# Altium project CCA-00012__sdaf__A.PrjPcb
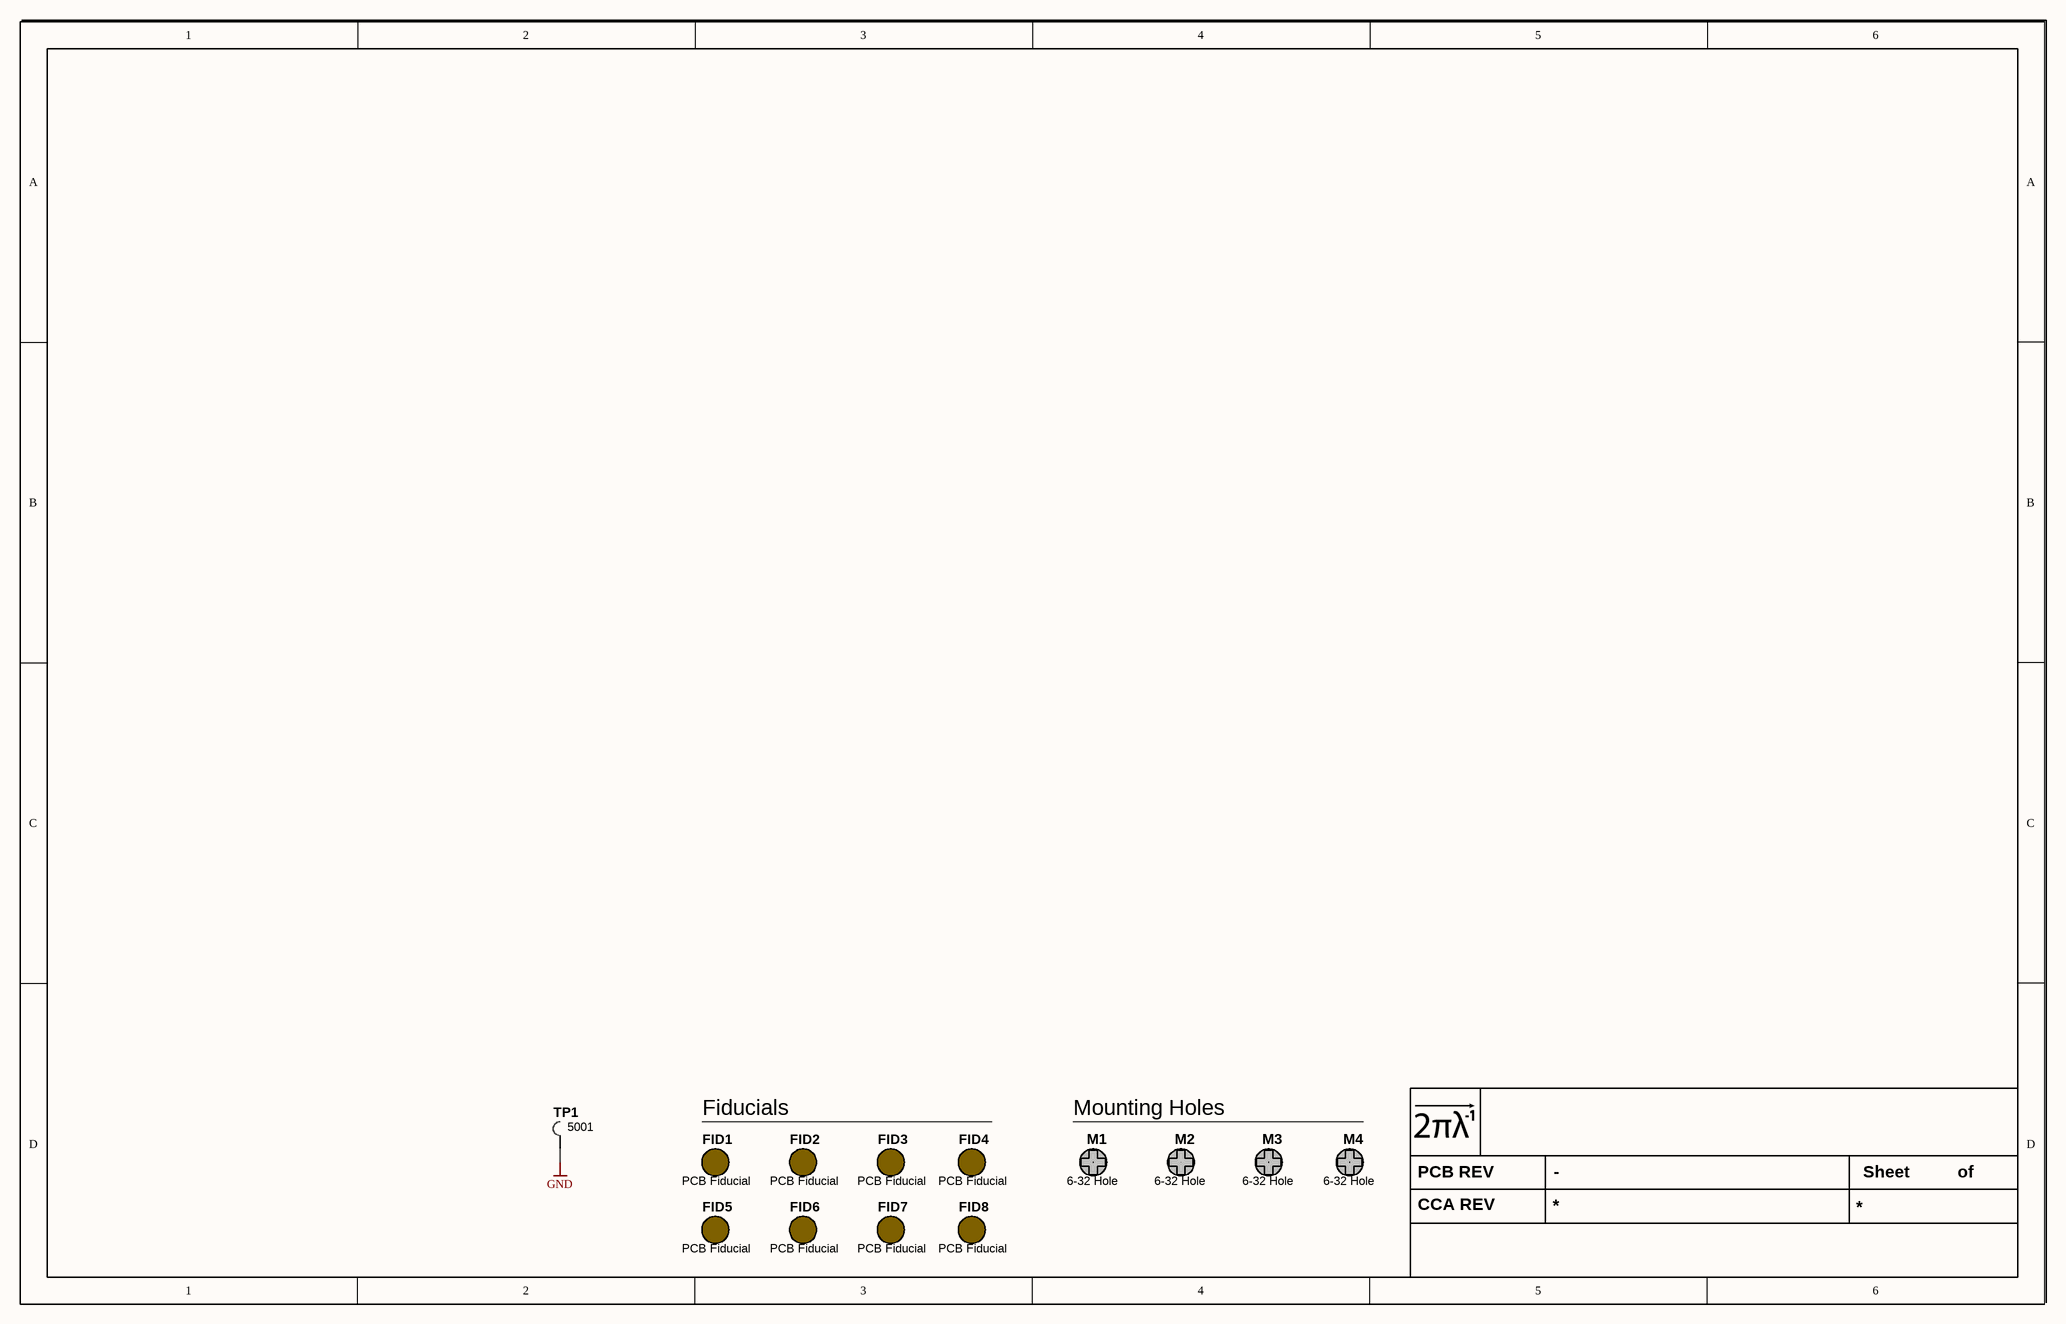
[diagram p0:  sdaf__TOP_LEVEL__A.SchDoc]
 CCA_PART_NUMBER: CCA-00012;  CCA_TITLE: sdaf;  PCB_PART_NUMBER: sdaf;  PCB_VERSION: A;  PROJECT_ENGINEER: plexus;  PROJECT_STATUS: PROTOTYPE;  PROJECT_TITLE_LINE_1: RT685 Audio Platform;  SCH_DATE: 2023-12-08
1 sheet, 13 parts. Net scope: global (net labels, ports and power ports of the same name join across sheets).
Board file:  sdaf__A.PcbDoc

## Sheet  sdaf__TOP_LEVEL__A.SchDoc
size B; Organization: Altium Limited; Address1: 3 Minna Close; Address2: Belrose; Address3: NSW 2085; Address4: Australia; PAGE_TITLE: -

### Parts
FID1  PCB Fiducial  [Fiducial 1mm - 2mm]  (no BOM)
FID2  PCB Fiducial  [Fiducial 1mm - 2mm]  (no BOM)
FID3  PCB Fiducial  [Fiducial 1mm - 2mm]  (no BOM)
FID4  PCB Fiducial  [Fiducial 1mm - 2mm]  (no BOM)
FID5  PCB Fiducial  [Fiducial 1mm - 2mm]  (no BOM)
FID6  PCB Fiducial  [Fiducial 1mm - 2mm]  (no BOM)
FID7  PCB Fiducial  [Fiducial 1mm - 2mm]  (no BOM)
FID8  PCB Fiducial  [Fiducial 1mm - 2mm]  (no BOM)
M1  6-32 Hole  [6-32 X 0]  (no BOM)
M2  6-32 Hole  [6-32 X 0]  (no BOM)
M3  6-32 Hole  [6-32 X 0]  (no BOM)
M4  6-32 Hole  [6-32 X 0]  (no BOM)
TP1  5001  [5001]

### Nets
GND: TP1.1

Not connected (* = marked no-connect by the designer): M1 1; M2 1; M3 1; M4 1

### Notes on the sheet
- Fiducials
- Mounting Holes
- PCB REV
- Sheet
- of
- CCA REV

### Library data of the parts
FID1-FID8 = Fiducial: Value: PCB Fiducial
TP1 = 5001: KEYSTONE - 5001 - TEST POINT, CONNECTOR, BLACK; Manufacturer: Keystone Electronics; Plating: Silver; Body Material: PBT,Bronze; Number of Ports: 1; Insulation: Insulated; Inside Diameter: 1.27mm; Outside Diameter: 2.54mm; Hole Diameter: 1.6mm; Value: 5001; Supplier 1: Digi-Key; Supplier Part Number 1: 36-5001-ND; Manufacturer Part Number: 5001; RoHS: Yes; Category: Test Probes, Leads and Clips; Stock: 463593; Pricing: 1=0.35000, 10=0.33500, 50=0.24380, 250=0.21032, 1000=0.17140, 2500=0.15296, 5000=0.14340 (USD); Mount: Through Hole,PCB; Color: Black; Contact Material: Bronze; Contact Plating: Silver,Tin; Material: Nylon,Bronze,Silver; Housing Color: Black; Packaging: Bulk; Package Quantity: 100; Termination: Through Hole; Number of Contacts: 1; Orientation: Straight; Diameter: 2.54mm; Length: 7.62mm; Height: 0.3inch; Lead Free: Lead Free; REACH SVHC: No SVHC; Flammability Rating: UL94 V-0; ComponentLink1URL: https://datasheet.ciiva.com/27052/1581986-27052611.pdf?src-supplier=Jameco; ComponentLink1Description: https://datasheet.ciiva.com/27052/1581986-27052611.pdf?src-supplier=Jameco; ComponentLink2URL: https://datasheet.ciiva.com/11836/0900766b8009b7c7-11836045.pdf?src-supplier=RSComponents; ComponentLink2Description: https://datasheet.ciiva.com/11836/0900766b8009b7c7-11836045.pdf?src-supplier=RSComponents; ComponentLink3URL: https://datasheet.ciiva.com/16318/m60-2p60-16318423.pdf?src-supplier=Future+Electronics; ComponentLink3Description: https://datasheet.ciiva.com/16318/m60-2p60-16318423.pdf?src-supplier=Future+Electronics; ComponentLink4URL: https://datasheet.ciiva.com/22631/1703983-22631100.pdf?src-supplier=Element14; ComponentLink4Description: https://datasheet.ciiva.com/22631/1703983-22631100.pdf?src-supplier=Element14
M1-M4 = 6-32 Hole: Source: Digikey; Source Part Number: *; Manufacturer: *; Manufacturer Part Number: *; ROHS Certificate: *; Value: *

## Assembly variants
 A: all parts fitted